# EasyEDA Pro project ProDoc_Avaota F1_2025-04-17.epro, schematic Main
Board Name: Avaota F1; Create Date: 2025-01-01; Page Name: P1; Project Name: AvaotaF1双核RV32迷你Linux无线视觉模块; Schematic Name: Main; Update Date: 2025-03-09; Company: YuzukiHD; Draw By: GloomyGhost; REV: 1.0
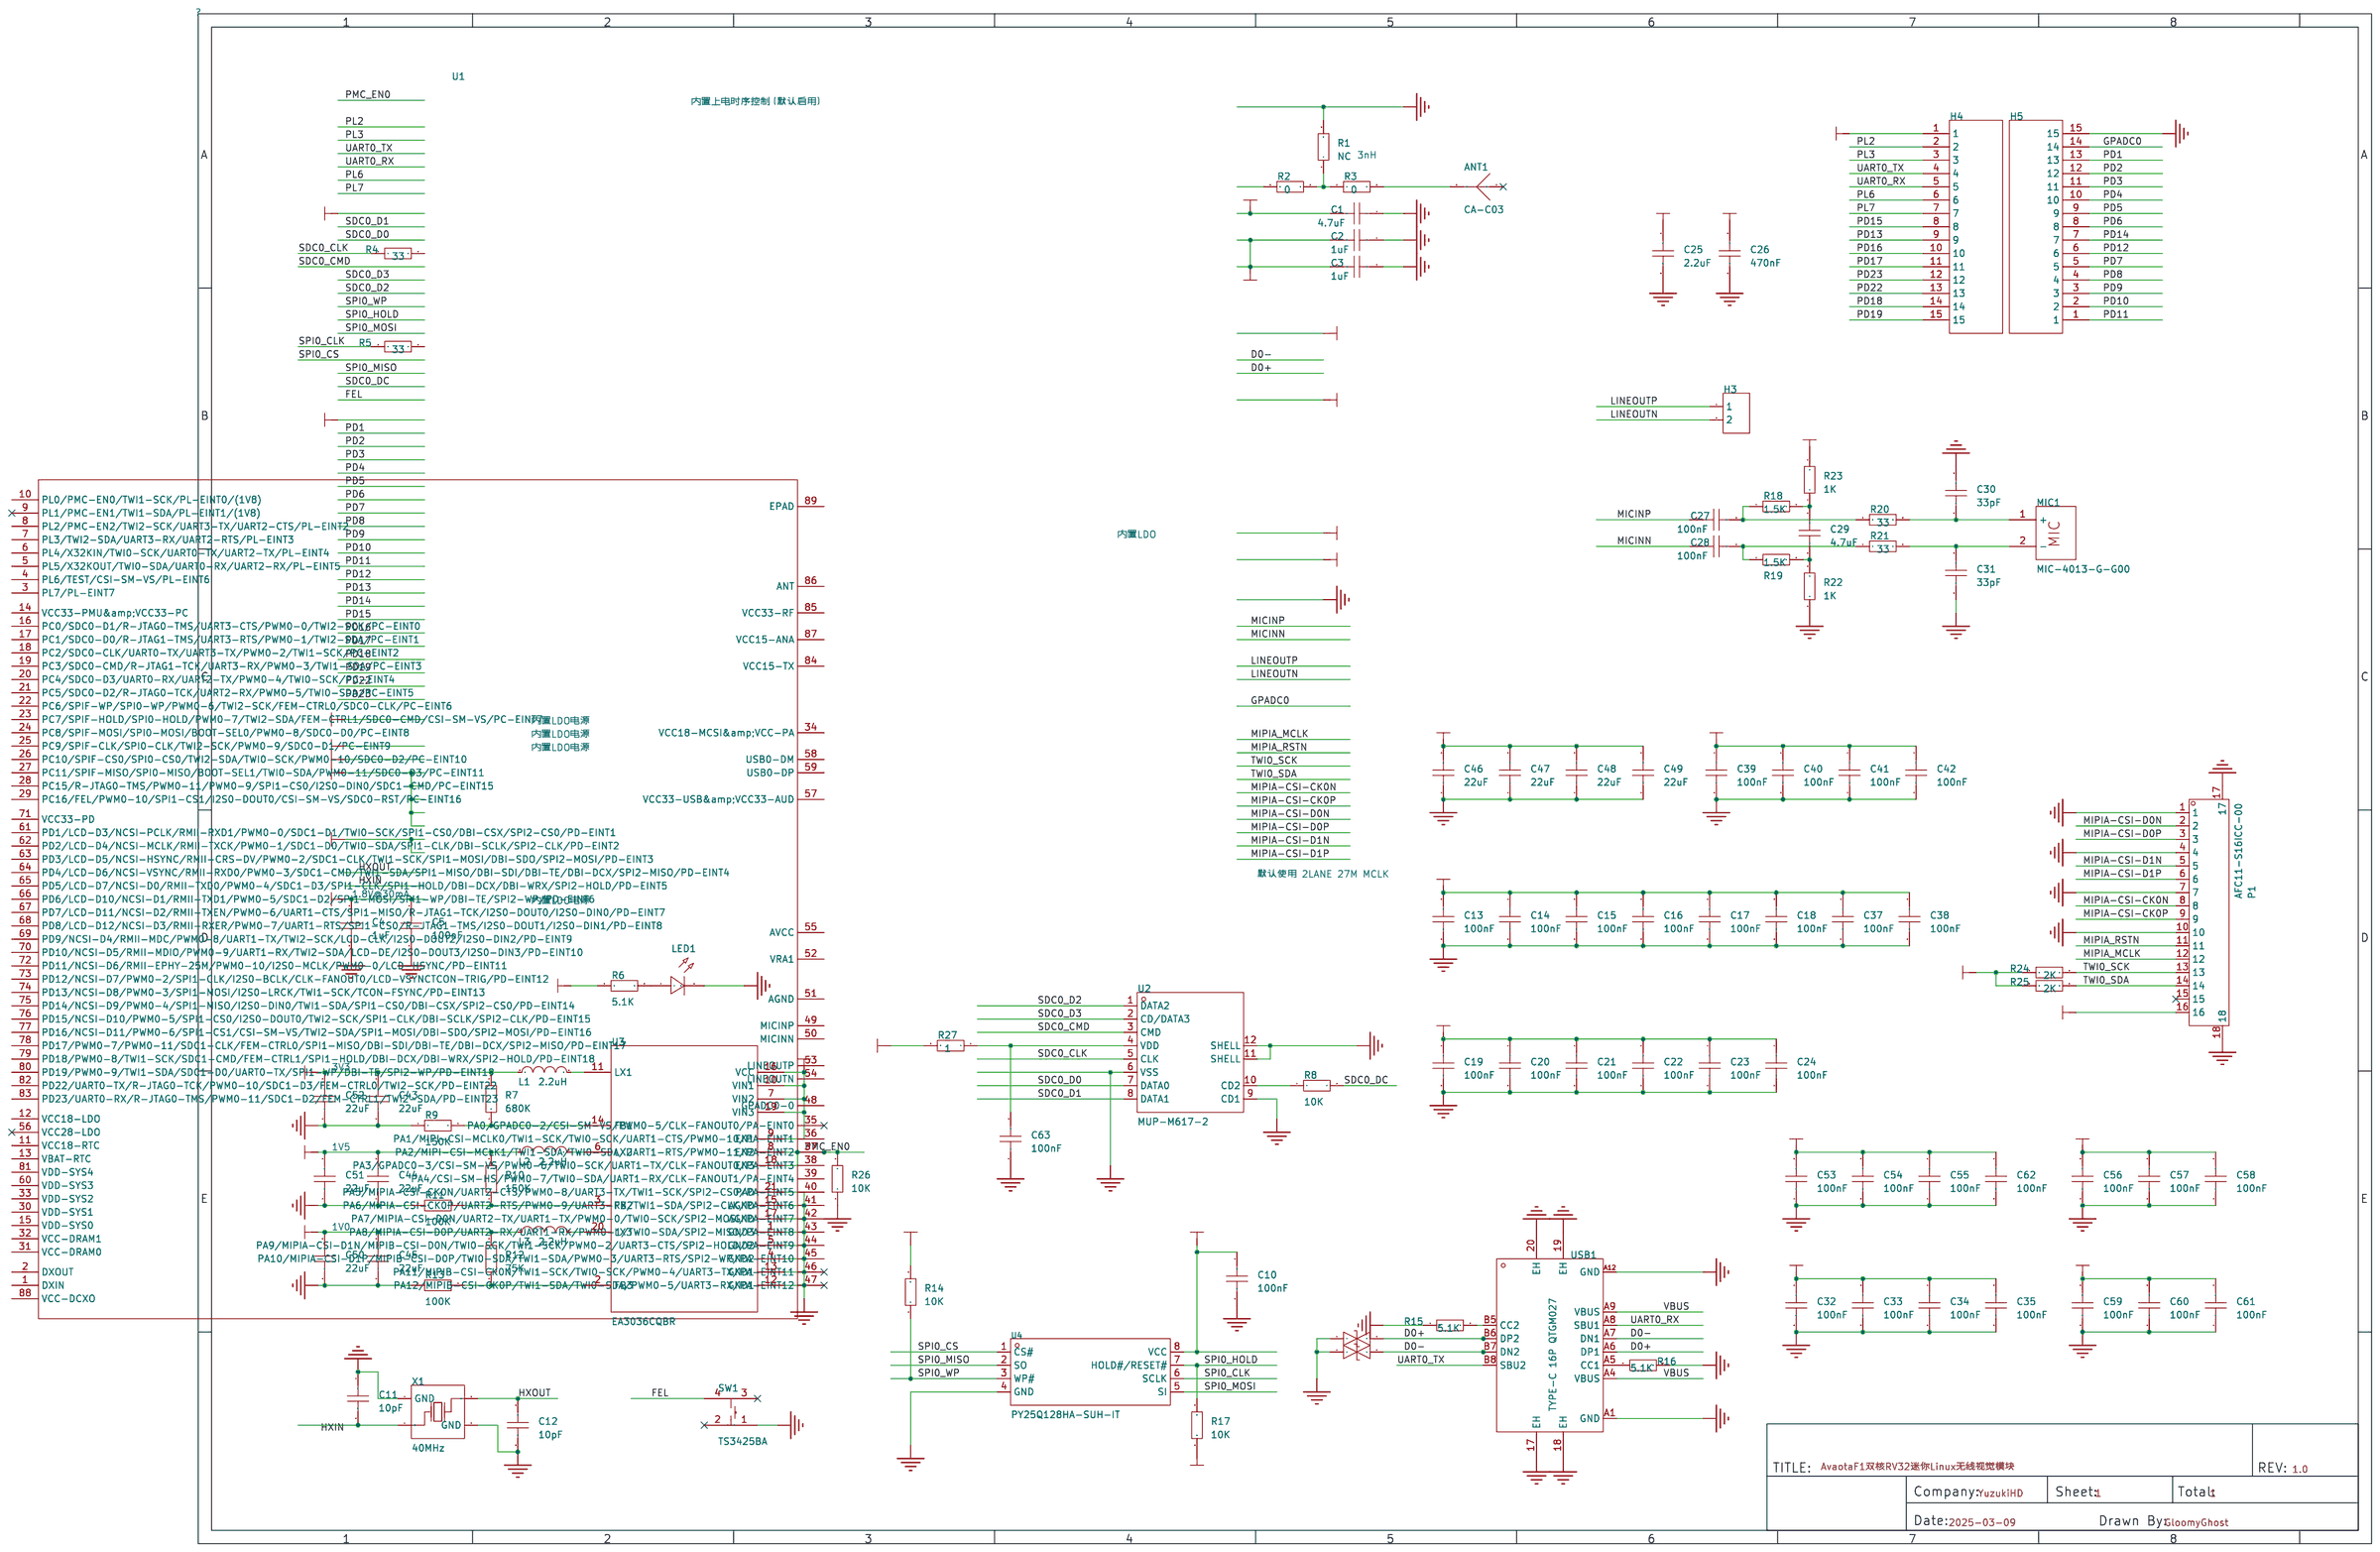
[diagram p0: schematic sheet]

## Parts
ANT1  CA-C03  [ANT-SMD_CA-C03]
C1  4.7uF  [C0201 NSK]
C2  1uF  [C0201 NSK]
C3  1uF  [C0201 NSK]
C4  1uF  [C0201 NSK]
C5  100nF  [C0201 NSK]
C10  100nF  [C0201 NSK]
C11  10pF  [C0201 NSK]
C12  10pF  [C0201 NSK]
C13  100nF  [C0201 NSK]
C14  100nF  [C0201 NSK]
C15  100nF  [C0201 NSK]
C16  100nF  [C0201 NSK]
C17  100nF  [C0201 NSK]
C18  100nF  [C0201 NSK]
C19  100nF  [C0201 NSK]
C20  100nF  [C0201 NSK]
C21  100nF  [C0201 NSK]
C22  100nF  [C0201 NSK]
C23  100nF  [C0201 NSK]
C24  100nF  [C0201 NSK]
C25  2.2uF  [C0201 NSK]
C26  470nF  [C0201 NSK]
C27  100nF  [C0201 NSK]
C28  100nF  [C0201 NSK]
C29  4.7uF  [C0201 NSK]
C30  33pF  [C0201 NSK]
C31  33pF  [C0201 NSK]
C32  100nF  [C0201 NSK]
C33  100nF  [C0201 NSK]
C34  100nF  [C0201 NSK]
C35  100nF  [C0201 NSK]
C37  100nF  [C0201 NSK]
C38  100nF  [C0201 NSK]
C39  100nF  [C0201 NSK]
C40  100nF  [C0201 NSK]
C41  100nF  [C0201 NSK]
C42  100nF  [C0201 NSK]
C43  22uF  [C0603-NSK]
C44  22uF  [C0603-NSK]
C45  22uF  [C0603-NSK]
C46  22uF  [C0603-NSK]
C47  22uF  [C0603-NSK]
C48  22uF  [C0603-NSK]
C49  22uF  [C0603-NSK]
C50  22uF  [C0603-NSK]
C51  22uF  [C0603-NSK]
C52  22uF  [C0603-NSK]
C53  100nF  [C0402-NSK]
C54  100nF  [C0402-NSK]
C55  100nF  [C0402-NSK]
C56  100nF  [C0402-NSK]
C57  100nF  [C0402-NSK]
C58  100nF  [C0402-NSK]
C59  100nF  [C0402-NSK]
C60  100nF  [C0402-NSK]
C61  100nF  [C0402-NSK]
C62  100nF  [C0201 NSK]
C63  100nF  [C0402-NSK]
D1  0402ESDA-05N  [D0402]
D2  0402ESDA-05N  [D0402]
H3  -  [HDR-TH_2P-P2.54-V-F]
H4  -  [2.54PHSM-1X15P]
H5  -  [2.54PHSM-1X15P]
L1  2.2uH  [IND-SMD_L2.0-W1.6]
L2  2.2uH  [IND-SMD_L2.0-W1.6]
L3  2.2uH  [IND-SMD_L2.0-W1.6]
LED1  -  [RGBLED_0807]
MIC1  MIC-4013-G-G00  [MIC-SMD_BD4.0-4013_SMDA]
P1  AFC11-S16ICC-00  [FPC-SMD_16P-L13.5-W2.0-P0.50]
R1  NC  [R0201 NSK]
R2  0  [R0201 NSK]
R3  0  [R0201 NSK]
R4  33  [R0201 NSK]
R5  33  [R0201 NSK]
R6  5.1K  [R0201 NSK]
R7  680K  [R0201 NSK]
R8  10K  [R0201 NSK]
R9  150K  [R0201 NSK]
R10  150K  [R0201 NSK]
R11  100K  [R0201 NSK]
R12  75K  [R0201 NSK]
R13  100K  [R0201 NSK]
R14  10K  [R0201 NSK]
R15  5.1K  [R0201 NSK]
R16  5.1K  [R0201 NSK]
R17  10K  [R0201 NSK]
R18  1.5K  [R0201 NSK]
R19  1.5K  [R0201 NSK]
R20  33  [R0201 NSK]
R21  33  [R0201 NSK]
R22  1K  [R0201 NSK]
R23  1K  [R0201 NSK]
R24  2K  [R0201 NSK]
R25  2K  [R0201 NSK]
R26  10K  [R0201 NSK]
R27  1  [R0402-NSK]
SW1  TS3425BA  [SW-SMD_4P-L4.2-W3.2-P2.15-LS4.6-1]
U1  V821x2-xXX  [QFN-88_L9.0-W9.0-P0.35-BL-EP5.26]
U2  MUP-M617-2  [TF-SMD_MUP-M617-2]
U3  EA3036CQBR  [WQFN-20_L3.0-W3.0-P0.40-BL-EP]
U4  PY25Q128HA-SUH-IT  [SOP-8_L5.2-W5.3-P1.27-LS7.9-BL]
USB1  TYPE-C 16P QTGM027  [USB-C-SMD_TYPE-C-16P-QTGM027]
X1  40MHz  [osc-smd_4p-l2.0-w1.6-bl]

## Library data of the parts
ANT1 = CA-C03: Supplier Part: C2838842; Supplier Footprint: 5520; JLCPCB Part Class: Extended Part; Datasheet: 2021-06-05/34112A/eaa7f794ae26492fadde70fdd3fe967f/CA-C03应用手册.pdf; Supplier: LCSC
C1-C5 C10-C35 C37-C42 C62 = CL03A104KQ3NNNC: 容值:100nF;精度:±10%;额定电压:6.3V;材质(温度系数):X5R;; LCSC Part Name: 100nF ±10% 6.3V; Supplier Part: C160831; Manufacturer: SAMSUNG(三星); Supplier Footprint: 0201; JLCPCB Part Class: Extended Part; Datasheet: https://atta.szlcsc.com/upload/public/pdf/source/20171228/C163510_15144412327381213809.pdf; Supplier: LCSC; Tolerance: ±10%; Voltage Rated: 6.3V; Temperature Coefficient: X5R
C43-C52 = CAP_0603: Supplier Footprint: 0603
C53-C61 C63 = CAP_0402: Supplier Footprint: 0402
D1 D2 = 0402ESDA-05N: 极性:双向;反向截止电压(Vrwm):5V;最大钳位电压:50V;; LCSC Part Name: 双向ESD; Supplier Part: C316049; Manufacturer: BORN(伯恩半导体); Supplier Footprint: 0402; JLCPCB Part Class: Extended Part; Datasheet: https://atta.szlcsc.com/upload/public/pdf/source/20181026/C316051_3197CA7AF3730883CA62970815D4F79F.pdf; Supplier: LCSC; polarity: 双向; Reverse Stand-Off Voltage (Vrwm): 5V; Maximum Clamping Voltage: 50V; Type: ESD; Check: false
H3 = HDR-F_2.54_1x2P: Supplier Part: C49661; Supplier Footprint: 插件
H4 H5 = 2.54PHSM-1X15P: Supplier: LCSC; Supplier Part: C2905491; Manufacturer: kinghelm(金航标); Manufacturer Part: KH-2.54PH180-1X16P-L11.5
L1-L3 = CKCS201610-2.2uH/M: 电感值:2.2uH;精度:±20%;额定电流:1.1A;直流电阻(DCR):264mΩ;; LCSC Part Name: 2.2uH ±20% 1.1A 264mΩ; Supplier Part: C354533; Manufacturer: CENKER(岑科); Supplier Footprint: SMD; JLCPCB Part Class: 扩展库; Datasheet: https://atta.szlcsc.com/upload/public/pdf/source/20190315/C354533_59121B22FE01331804674A67C9C7C2C4.pdf; Supplier: LCSC; Tolerance: ±20%; Rated Current: 1.1A; DC Resistance (DCR): 264mΩ
LED1 = LED_0807-RGB: Supplier Footprint: 0805
MIC1 = MIC-4013-G-G00: MIC-4013-G-G00 绿板高温绑定无电容 MIC咪头 灵敏度36-38db; Supplier Part: C42371093; Manufacturer: SAMZO(三佐); Supplier Footprint: SMD,D=4mm; JLCPCB Part Class: Extended Part; Datasheet: https://atta.szlcsc.com/upload/public/pdf/source/20241028/0B366D76845CA719AC12F164ABD6B254.pdf; Supplier: LCSC
P1 = AFC11-S16ICC-00: 锁定特性:抽屉式;触点类型:单侧触点/垂直;触点数量:16P;间距:0.5mm;安装类型:立贴;; LCSC Part Name: 间距:0.5mm P数:16P 抽屉式 单侧触点/垂直; Supplier Part: C11071; Manufacturer: JS(钜硕电子); Supplier Footprint: SMD,P=0.5mm; JLCPCB Part Class: 扩展库; Datasheet: https://atta.szlcsc.com/upload/public/pdf/source/20191211/C466537_F6F2472ADACFFA77E875AFE9DAB8E0AD.pdf; Supplier: LCSC; Locking Feature: 抽屉式; Contact Type: 单侧触点/垂直; Number of Contacts: 16P; Pitch: 0.5mm; Mounting Type: 立贴; FFC, FCB Thickness: 0.3mm; Height Above Board: 4.4mm
R1-R26 = Res_0201: Supplier Footprint: 0201
R27 = Res_0402: Supplier Footprint: 0402
SW1 = TS3425BA: 电路结构:单刀单掷;按钮形状:椭圆形按钮;作用力:250gf;安装方式:立贴;开关长度:4.2mm;开关宽度:3.2mm;开关高度:2.5mm;带支架:不带;触点电流:50mA;额定电压(DC):12V;绝缘电阻:100MΩ;机械寿命:10万次;; LCSC Part Name: 4.2*3.2*2.5mm 立贴 轻触开关; Supplier Part: C2681476; Manufacturer: SHOU HAN(首韩); Supplier Footprint: SMD; JLCPCB Part Class: 扩展库; Datasheet: https://atta.szlcsc.com/upload/public/pdf/source/20210107/C2681476_BF217B2301F0070AA49504CB0BFDE895.pdf; Supplier: LCSC; Circuit: 单刀单掷; Actuator Style: 椭圆形按钮; Operating Force: 250gf; Mounting Style: 立贴; Switch Length: 4.2mm; Switch Width: 3.2mm; Switch Height: 2.5mm; Strike Gundam: 不带; Contact Current: 50mA; Voltage Rating (DC): 12V; Insulation Resistance: 100MΩ; Actuator/Cap Color: 白色; Pin Style: J型引脚; Mechanical Life: 10万次; Operating Temperature: -20℃~+85℃
U1 = V821x2-xXX
U2 = MUP-M617-2: 卡类型:MicroSD卡(TF卡);连接器类型:卡座;本体最大高度:2.6mm;; LCSC Part Name: MicroSD卡(TF卡) 卡座; Supplier Part: C5205359; Manufacturer: MUP(德海威); Supplier Footprint: SMD; JLCPCB Part Class: 扩展库; Datasheet: https://atta.szlcsc.com/upload/public/pdf/source/20221020/4B0355AF259603421FB1BB81F444530F.pdf; Supplier: LCSC; Card Type: MicroSD卡(TF卡); Connector Type: 卡座; Maximum Body Height: 2.6mm
U3 = EA3036CQBR: 3路PMU,输入电压 2.7V~5.5V，输出电压 0.6V~Vin  输出电流1.2A/1.5A/1.2A; LCSC Part Name: EA3036; Supplier Part: C570857; Manufacturer: everanalog(申风); Supplier Footprint: WQFN-20-EP(3x3); JLCPCB Part Class: 扩展库; Datasheet: https://atta.szlcsc.com/upload/public/pdf/source/20200529/C570857_65255DA4FBC4C795D9FF4AFE8A3669F7.pdf; Supplier: LCSC
U4 = PY25Q128HA-SUH-IT: Supplier Part: C7419750; Manufacturer: PUYA(普冉); Supplier Footprint: SOP-8; JLCPCB Part Class: 扩展库; Supplier: LCSC
USB1 = TYPE-C 16P QTGM027: 连接器类型:Type-C;标准:USB 3.1;公母:母;安装方式:卧贴;触点数量:16P;端口数量:1;额定电流 - 电源:3A;工作温度范围:-30℃~+80℃;; LCSC Part Name: Type-C 母 卧贴; Supplier Part: C2681552; Manufacturer: SHOU HAN(首韩); Supplier Footprint: SMD; JLCPCB Part Class: 扩展库; Datasheet: https://atta.szlcsc.com/upload/public/pdf/source/20210224/C2681552_6D044BA0C1A7352EAF06092454113915.pdf; Supplier: LCSC; Connector Type: Type-C; Standard: USB 3.1; Gender: 母; Mounting Style: 卧贴; Number of Contacts: 16P; Number of Ports: 1; Current Rating - Power (Max): 3A; Operating Temperature Range: -30℃~+80℃; Rated Voltage (Max): 20V; Connect-Disconnect Life: 5千次; Core Colour: 黑色
X1 = Q22FA12800489: 晶振类型:贴片无源晶振;频率:24MHz;频率公差:±10ppm;频率稳定度:-;负载电容:12pF;等效串联电阻(ESR):80Ω;工作温度:-40~+85;; LCSC Part Name: 24MHz ±10ppm 内置负载电容:12pF; Supplier Part: C255882; Manufacturer: EPSON(爱普生); Supplier Footprint: SMD2016-4P; JLCPCB Part Class: Extended Part; Datasheet: https://atta.szlcsc.com/upload/public/pdf/source/20180822/C255882_083B581EA571105FFBC8E49F93F67D9B.pdf; Supplier: LCSC; Crystal Type: 贴片无源晶振; Frequency Tolerance: ±10ppm; Load Capacitance: 12pF; Equivalent Series Resistance (ESR): 80Ω; Operating Temperature: -40~+85

## Nets
0V9: C19.1 C20.1 C21.1 C22.1 C23.1 C24.1 C45.2 C50.2 C56.2 C57.2 C58.2 L3.1 R12.2
1V5: C2.2 C3.2 C39.1 C40.1 C41.1 C42.1 C44.2 C51.2 C59.2 C60.2 C61.2 L2.1 R10.2
1V8: C32.1 C33.1 C34.1 C35.1 R24.1 R25.1
1V8-AON: C4.1 C5.1
3V3: C1.2 C10.1 C13.1 C14.1 C15.1 C16.1 C17.1 C18.1 C37.1 C38.1 C43.2 C52.2 C53.2 C54.2 C55.2 C62.1 H4.1 L1.1 P1.16 R6.1 R7.2 R14.2 R17.1 R27.2 U4.8(VCC)
AVCC: C25.1 R23.2
GND: C1.1 C2.1 C3.1 C4.2 C5.2 C10.2 C11.1 C12.2 C13.2 C14.2 C15.2 C16.2 C17.2 C18.2 C19.2 C20.2 C21.2 C22.2 C23.2 C24.2 C25.2 C26.2 C30.1 C31.2 C32.2 C33.2 C34.2 C35.2 C37.2 C38.2 C39.2 C40.2 C41.2 C42.2 C43.1 C44.1 C45.1 C46.1 C47.1 C48.1 C49.1 C50.1 C51.1 C52.1 C53.1 C54.1 C55.1 C56.1 C57.1 C58.1 C59.1 C60.1 C61.1 C62.2 C63.1 D1.1 D2.1 H5.15 LED1.2(C) P1.1 P1.4 P1.7 P1.10 P1.17 P1.18 R1.2 R9.1 R11.1 R13.1 R15.1 R16.2 R22.1 R26.1 SW1.1 U2.6(VSS) U2.9(CD1) U2.11(SHELL) U2.12(SHELL) U3.1(GND3) U3.4(GND2) U3.5(GND2) U3.12(GND1) U3.13(GND1) U3.15(AGND) U3.17(AGND) U3.21(PAD) U4.4(GND) USB1.17(EH) USB1.18(EH) USB1.19(EH) USB1.20(EH) USB1.A1(GND) USB1.A12(GND) X1.2(GND) X1.4(GND)
VBUS: C46.2 C47.2 C48.2 C49.2 U3.7(VIN2) U3.9(EN1) U3.10(VIN1) U3.16(VCC) U3.19(VIN3) USB1.A4(VBUS) USB1.A9(VBUS)
D0+: D1.2 USB1.A6(DP1) USB1.B6(DP2)
D0-: D2.2 USB1.A7(DN1) USB1.B7(DN2)
FEL: SW1.4
GPADC0: H5.14
HXIN: C11.2 X1.1(OSC1)
HXOUT: C12.1 X1.3(OSC2)
LINEOUTN: H3.2
LINEOUTP: H3.1
MICINN: C28.1
MICINP: C27.1
MIPIA-CSI-CK0N: P1.8
MIPIA-CSI-CK0P: P1.9
MIPIA-CSI-D0N: P1.2
MIPIA-CSI-D0P: P1.3
MIPIA-CSI-D1N: P1.5
MIPIA-CSI-D1P: P1.6
MIPIA_MCLK: P1.12
MIPIA_RSTN: P1.11
PD1: H5.13
PD2: H5.12
PD3: H5.11
PD4: H5.10
PD5: H5.9
PD6: H5.8
PD7: H5.5
PD8: H5.4
PD9: H5.3
PD10: H5.2
PD11: H5.1
PD12: H5.6
PD13: H4.9
PD14: H5.7
PD15: H4.8
PD16: H4.10
PD17: H4.11
PD18: H4.14
PD19: H4.15
PD22: H4.13
PD23: H4.12
PL2: H4.2
PL3: H4.3
PL6: H4.6
PL7: H4.7
PMC_EN0: R26.2 U1.37(PA2/MIPI-CSI-MCLK1/TWI1-SDA/TWI0-SDA/UART1-RTS/PWM0-11/PA-EINT2) U3.8(EN2) U3.18(EN3)
SDC0_CLK: R4.1 U2.5(CLK)
SDC0_CMD: U2.3(CMD)
SDC0_D0: U2.7(DATA0)
SDC0_D1: U2.8(DATA1)
SDC0_D2: U2.1(DATA2)
SDC0_D3: U2.2(CD/DATA3)
SDC0_DC: R8.2
SPI0_CLK: R5.1 U4.6(SCLK)
SPI0_CS: U4.1(CS#)
SPI0_HOLD: R17.2 U4.7(HOLD#/RESET#)
SPI0_MISO: U4.2(SO)
SPI0_MOSI: U4.5(SI)
SPI0_WP: R14.1 U4.3(WP#)
TWI0_SCK: P1.13 R24.2
TWI0_SDA: P1.14 R25.2
UART0_RX: H4.5 USB1.A8(SBU1)
UART0_TX: H4.4 USB1.B8(SBU2)
VRA1: C26.1
$1N78208: C63.2 R27.1 U2.4(VDD)
$1N78221: R8.1 U2.10(CD2)
$1N78347: R1.1 R2.2 R3.1
$1N78353: ANT1.2(ANT) R3.2
$1N79510: LED1.1(A) R6.2
$1N80715: R15.2 USB1.B5(CC2)
$1N80801: R16.1 USB1.A5(CC1)
$1N82766: R7.1 R9.2 U3.14(FB1)
$1N82929: L1.2 U3.11(LX1)
$1N83072: R10.1 R11.2 U3.3(FB2)
$1N83076: L2.2 U3.6(LX2)
$1N83335: R12.1 R13.2 U3.2(FB3)
$1N83339: L3.2 U3.20(LX3)
$1N85174: C27.2 R18.1 R20.1
$1N85232: C29.1 R18.2 R23.1
$1N85237: C28.2 R19.1 R21.1
$1N85241: C29.2 R19.2 R22.2
$1N85511: C31.1 MIC1.2(-) R21.2
$1N85515: C30.2 MIC1.1(+) R20.2

Not connected (* = marked no-connect by the designer): ANT1 1*; P1 15*; R2 1; R4 2; R5 2; SW1 2* 3*; U1 1(DXIN) 2(DXOUT) 3(PL7/PL-EINT7) 4(PL6/TEST/CSI-SM-VS/PL-EINT6) 5(PL5/X32KOUT/TWI0-SDA/UART0-RX/UART2-RX/PL-EINT5) 6(PL4/X32KIN/TWI0-SCK/UART0-TX/UART2-TX/PL-EINT4) 7(PL3/TWI2-SDA/UART3-RX/UART2-RTS/PL-EINT3) 8(PL2/PMC-EN2/TWI2-SCK/UART3-TX/UART2-CTS/PL-EINT2) 9(PL1/PMC-EN1/TWI1-SDA/PL-EINT1/(1V8))* 10(PL0/PMC-EN0/TWI1-SCK/PL-EINT0/(1V8)) 11(VCC18-RTC) 12(VCC18-LDO) 13(VBAT-RTC) 14(VCC33-PMU&amp;VCC33-PC) 15(VDD-SYS0) 16(PC0/SDC0-D1/R-JTAG0-TMS/UART3-CTS/PWM0-0/TWI2-SCK/PC-EINT0) 17(PC1/SDC0-D0/R-JTAG1-TMS/UART3-RTS/PWM0-1/TWI2-SDA/PC-EINT1) 18(PC2/SDC0-CLK/UART0-TX/UART3-TX/PWM0-2/TWI1-SCK/PC-EINT2) 19(PC3/SDC0-CMD/R-JTAG1-TCK/UART3-RX/PWM0-3/TWI1-SDA/PC-EINT3) 20(PC4/SDC0-D3/UART0-RX/UART2-TX/PWM0-4/TWI0-SCK/PC-EINT4) 21(PC5/SDC0-D2/R-JTAG0-TCK/UART2-RX/PWM0-5/TWI0-SDA/PC-EINT5) 22(PC6/SPIF-WP/SPI0-WP/PWM0-6/TWI2-SCK/FEM-CTRL0/SDC0-CLK/PC-EINT6) 23(PC7/SPIF-HOLD/SPI0-HOLD/PWM0-7/TWI2-SDA/FEM-CTRL1/SDC0-CMD/CSI-SM-VS/PC-EINT7) 24(PC8/SPIF-MOSI/SPI0-MOSI/BOOT-SEL0/PWM0-8/SDC0-D0/PC-EINT8) 25(PC9/SPIF-CLK/SPI0-CLK/TWI2-SCK/PWM0-9/SDC0-D1/PC-EINT9) 26(PC10/SPIF-CS0/SPI0-CS0/TWI2-SDA/TWI0-SCK/PWM0-10/SDC0-D2/PC-EINT10) 27(PC11/SPIF-MISO/SPI0-MISO/BOOT-SEL1/TWI0-SDA/PWM0-11/SDC0-D3/PC-EINT11) 28(PC15/R-JTAG0-TMS/PWM0-11/PWM0-9/SPI1-CS0/I2S0-DIN0/SDC1-CMD/PC-EINT15) 29(PC16/FEL/PWM0-10/SPI1-CS1/I2S0-DOUT0/CSI-SM-VS/SDC0-RST/PC-EINT16) 30(VDD-SYS1) 31(VCC-DRAM0) 32(VCC-DRAM1) 33(VDD-SYS2) 34(VCC18-MCSI&amp;VCC-PA) 35(PA0/GPADC0-2/CSI-SM-VS/PWM0-5/CLK-FANOUT0/PA-EINT0)* 36(PA1/MIPI-CSI-MCLK0/TWI1-SCK/TWI0-SCK/UART1-CTS/PWM0-10/PA-EINT1) 38(PA3/GPADC0-3/CSI-SM-VS/PWM0-6/TWI0-SCK/UART1-TX/CLK-FANOUT0/PA-EINT3) 39(PA4/CSI-SM-HS/PWM0-7/TWI0-SDA/UART1-RX/CLK-FANOUT1/PA-EINT4) 40(PA5/MIPIA-CSI-CK0N/UART2-CTS/PWM0-8/UART3-TX/TWI1-SCK/SPI2-CS0/PA-EINT5) 41(PA6/MIPIA-CSI-CK0P/UART2-RTS/PWM0-9/UART3-RX/TWI1-SDA/SPI2-CLK/PA-EINT6) 42(PA7/MIPIA-CSI-D0N/UART2-TX/UART1-TX/PWM0-0/TWI0-SCK/SPI2-MOSI/PA-EINT7) 43(PA8/MIPIA-CSI-D0P/UART2-RX/UART1-RX/PWM0-1/TWI0-SDA/SPI2-MISO/PA-EINT8) 44(PA9/MIPIA-CSI-D1N/MIPIB-CSI-D0N/TWI0-SCK/TWI1-SCK/PWM0-2/UART3-CTS/SPI2-HOLD/PA-EINT9) 45(PA10/MIPIA-CSI-D1P/MIPIB-CSI-D0P/TWI0-SDA/TWI1-SDA/PWM0-3/UART3-RTS/SPI2-WP/PA-EINT10) 46(PA11/MIPIB-CSI-CK0N/TWI1-SCK/TWI0-SCK/PWM0-4/UART3-TX/PA-EINT11)* 47(PA12/MIPIB-CSI-CK0P/TWI1-SDA/TWI0-SDA/PWM0-5/UART3-RX/PA-EINT12)* 48(GPADC0-0) 49(MICINP) 50(MICINN) 51(AGND) 52(VRA1) 53(LINEOUTP) 54(LINEOUTN) 55(AVCC) 56(VCC28-LDO)* 57(VCC33-USB&amp;VCC33-AUD) 58(USB0-DM) 59(USB0-DP) 60(VDD-SYS3) 61(PD1/LCD-D3/NCSI-PCLK/RMII-RXD1/PWM0-0/SDC1-D1/TWI0-SCK/SPI1-CS0/DBI-CSX/SPI2-CS0/PD-EINT1) 62(PD2/LCD-D4/NCSI-MCLK/RMII-TXCK/PWM0-1/SDC1-D0/TWI0-SDA/SPI1-CLK/DBI-SCLK/SPI2-CLK/PD-EINT2) 63(PD3/LCD-D5/NCSI-HSYNC/RMII-CRS-DV/PWM0-2/SDC1-CLK/TWI1-SCK/SPI1-MOSI/DBI-SDO/SPI2-MOSI/PD-EINT3) 64(PD4/LCD-D6/NCSI-VSYNC/RMII-RXD0/PWM0-3/SDC1-CMD/TWI1-SDA/SPI1-MISO/DBI-SDI/DBI-TE/DBI-DCX/SPI2-MISO/PD-EINT4) 65(PD5/LCD-D7/NCSI-D0/RMII-TXD0/PWM0-4/SDC1-D3/SPI1-CLK/SPI1-HOLD/DBI-DCX/DBI-WRX/SPI2-HOLD/PD-EINT5) 66(PD6/LCD-D10/NCSI-D1/RMII-TXD1/PWM0-5/SDC1-D2/SPI1-MOSI/SPI1-WP/DBI-TE/SPI2-WP/PD-EINT6) 67(PD7/LCD-D11/NCSI-D2/RMII-TXEN/PWM0-6/UART1-CTS/SPI1-MISO/R-JTAG1-TCK/I2S0-DOUT0/I2S0-DIN0/PD-EINT7) 68(PD8/LCD-D12/NCSI-D3/RMII-RXER/PWM0-7/UART1-RTS/SPI1-CS0/R-JTAG1-TMS/I2S0-DOUT1/I2S0-DIN1/PD-EINT8) 69(PD9/NCSI-D4/RMII-MDC/PWM0-8/UART1-TX/TWI2-SCK/LCD-CLK/I2S0-DOUT2/I2S0-DIN2/PD-EINT9) 70(PD10/NCSI-D5/RMII-MDIO/PWM0-9/UART1-RX/TWI2-SDA/LCD-DE/I2S0-DOUT3/I2S0-DIN3/PD-EINT10) 71(VCC33-PD) 72(PD11/NCSI-D6/RMII-EPHY-25M/PWM0-10/I2S0-MCLK/PWM0-0/LCD-HSYNC/PD-EINT11) 73(PD12/NCSI-D7/PWM0-2/SPI1-CLK/I2S0-BCLK/CLK-FANOUT0/LCD-VSYNCTCON-TRIG/PD-EINT12) 74(PD13/NCSI-D8/PWM0-3/SPI1-MOSI/I2S0-LRCK/TWI1-SCK/TCON-FSYNC/PD-EINT13) 75(PD14/NCSI-D9/PWM0-4/SPI1-MISO/I2S0-DIN0/TWI1-SDA/SPI1-CS0/DBI-CSX/SPI2-CS0/PD-EINT14) 76(PD15/NCSI-D10/PWM0-5/SPI1-CS0/I2S0-DOUT0/TWI2-SCK/SPI1-CLK/DBI-SCLK/SPI2-CLK/PD-EINT15) 77(PD16/NCSI-D11/PWM0-6/SPI1-CS1/CSI-SM-VS/TWI2-SDA/SPI1-MOSI/DBI-SDO/SPI2-MOSI/PD-EINT16) 78(PD17/PWM0-7/PWM0-11/SDC1-CLK/FEM-CTRL0/SPI1-MISO/DBI-SDI/DBI-TE/DBI-DCX/SPI2-MISO/PD-EINT17) 79(PD18/PWM0-8/TWI1-SCK/SDC1-CMD/FEM-CTRL1/SPI1-HOLD/DBI-DCX/DBI-WRX/SPI2-HOLD/PD-EINT18) 80(PD19/PWM0-9/TWI1-SDA/SDC1-D0/UART0-TX/SPI1-WP/DBI-TE/SPI2-WP/PD-EINT19) 81(VDD-SYS4) 82(PD22/UART0-TX/R-JTAG0-TCK/PWM0-10/SDC1-D3/FEM-CTRL0/TWI2-SCK/PD-EINT22) 83(PD23/UART0-RX/R-JTAG0-TMS/PWM0-11/SDC1-D2/FEM-CTRL1/TWI2-SDA/PD-EINT23) 84(VCC15-TX) 85(VCC33-RF) 86(ANT) 87(VCC15-ANA) 88(VCC-DCXO) 89(EPAD)

## Notes on the sheet
- 内置上电时序控制（默认启用）
- 3nH
- 内置LDO
- 内置LDO电源
- 内置LDO电源
- 内置LDO电源
- 默认使用 2LANE 27M MCLK
- 1.8V@30mA
- 内置LDO电源
- 3V3
- 1V5
- 1V0
